# Altium schematic sheet Sheet_1_2020-05-15_10-06-48.schdoc
size 234 x 147 mm
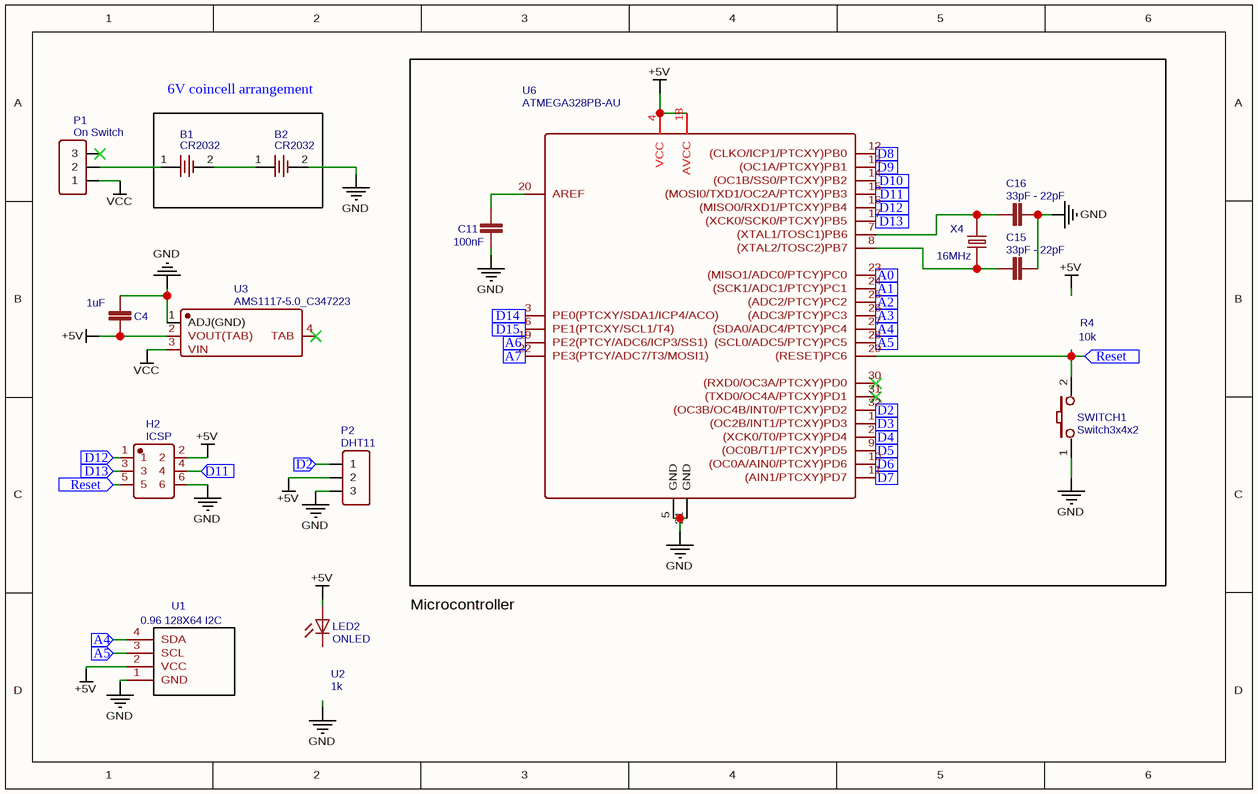
[diagram p0: Sheet_1_2020-05-15_10-06-48.schdoc]

## Parts
B1  CR2032  [BAT-TH_CR2032-BS-5-1]
B2  CR2032  [BAT-TH_CR2032-BS-5-1]
C4  1uF  [C805]
C11  100nF  [C805]
C15  33pF - 22pF  [C805]
C16  33pF - 22pF  [C805]
H2  ICSP  [HDR-TH_6P-P2.54-V-R2-C3-S2.54]
LED2  ONLED  [CHIPLED_0805]
P1  On Switch  [HDR-TH_3P-P2.54-V]
P2  DHT11  [HDR-TH_3P-P2.54-V]
R4  10k  [1206]
SWITCH1  Switch3x4x2  [KEY-3.0*4.0]
U1  0.96 128X64 I2C  [0.96 128X64 I2C SSD1306 OLED WHITE/BLUE]
U2  1k  [1206]
U3  AMS1117-5.0_C347223  [SOT-223_L6.7-W3.5-P2.30-BR]
U6  ATMEGA328PB-AU  [TQFP-32_7X7X08P]
X4  16MHz  [HC-49S_L11.4-W4.8]

## Blocks framed on the sheet
6V coincell arrangement: B1 B2

## Ports
A0 (in), A1 (in), A2 (in), A3 (in), A4 (in), A5 (in), A6 (in), A7 (in), D2 (in), D3 (in), D4 (in), D5 (in), D6 (in), D7 (in), D8 (in), D9 (in), D10 (in), D11 (in), D12 (in), D13 (in), D14 (in), D15 (in), Reset (in)

## Nets
+5V: C4.2 H2.2 LED2.A P2.2 U1.2(VCC) U3.2(VOUT(TAB)) U6.4(VCC) U6.18(AVCC)
GND: B2.2 C4.1 C11.2 C15.2 C16.1 H2.6 P2.3 SWITCH1.1 U1.1(GND) U3.1(ADJ(GND)) U6.5(GND) U6.21(GND)
VCC: P1.1 U3.3(VIN)
A0: U6.23((MISO1/ADC0/PTCY)PC0) ; port A0
A1: U6.24((SCK1/ADC1/PTCY)PC1) ; port A1
A2: U6.25((ADC2/PTCY)PC2) ; port A2
A3: U6.26((ADC3/PTCY)PC3) ; port A3
A4: U1.4(SDA) U6.27((SDA0/ADC4/PTCY)PC4) ; port A4
A5: U1.3(SCL) U6.28((SCL0/ADC5/PTCY)PC5) ; port A5
A6: U6.19(PE2(PTCY/ADC6/ICP3/SS1)) ; port A6
A7: U6.22(PE3(PTCY/ADC7/T3/MOSI1)) ; port A7
D2: P2.1 U6.32((OC3B/OC4B/INT0/PTCXY)PD2) ; port D2
D3: U6.1((OC2B/INT1/PTCXY)PD3) ; port D3
D4: U6.2((XCK0/T0/PTCXY)PD4) ; port D4
D5: U6.9((OC0B/T1/PTCXY)PD5) ; port D5
D6: U6.10((OC0A/AIN0/PTCXY)PD6) ; port D6
D7: U6.11((AIN1/PTCXY)PD7) ; port D7
D8: U6.12((CLKO/ICP1/PTCXY)PB0) ; port D8
D9: U6.13((OC1A/PTCXY)PB1) ; port D9
D10: U6.14((OC1B/SS0/PTCXY)PB2) ; port D10
D11: H2.4 U6.15((MOSI0/TXD1/OC2A/PTCXY)PB3) ; port D11
D12: H2.1 U6.16((MISO0/RXD1/PTCXY)PB4) ; port D12
D13: H2.3 U6.17((XCK0/SCK0/PTCXY)PB5) ; port D13
D14: U6.3(PE0(PTCXY/SDA1/ICP4/ACO)) ; port D14
D15: U6.6(PE1(PTCXY/SCL1/T4)) ; port D15
Reset: H2.5 SWITCH1.2 U6.29((RESET)PC6) ; port Reset
NetB1_1: B1.1 P1.2
NetB1_2: B1.2 B2.1
NetC11_1: C11.1 U6.20(AREF)
NetC15_1: C15.1 U6.8((XTAL2/TOSC2)PB7) X4.2
NetC16_2: C16.2 U6.7((XTAL1/TOSC1)PB6) X4.1

Not connected (* = marked no-connect by the designer): LED2 C; P1 3*; U3 4(TAB)*; U6 30((RXD0/OC3A/PTCXY)PD0)* 31((TXD0/OC4A/PTCXY)PD1)*

## Notes on the sheet
- Microcontroller

## Library data of the parts
B1 B2 = CR2032: BOM_Manufacturer: Q&J; BOM_Manufacturer Part: CR2032-BS-5-1; BOM_Supplier: LCSC; image: //image.lceda.cn/szlcsc/C70379.jpg; BOM_Supplier Part: C70379; spicePre: B; spiceSymbolName: CR2032-BS-5-1
C4 = 1uF: description: Non-Polarized capacitor in various packages; Contributor: DangerousPrototype; BOM_Manufacturer Part: ?; spicePre: C
C11 = 100nF: description: Non-Polarized capacitor in various packages; Contributor: DangerousPrototype; BOM_Manufacturer Part: ?; spicePre: C
C15 C16 = 33pF - 22pF: description: Non-Polarized capacitor in various packages; Contributor: DangerousPrototype; BOM_Manufacturer Part: ?; spicePre: C
H2 = ICSP: BOM_Manufacturer: ReliaPro; BOM_Manufacturer Part: Female header/2.54mm2x3 Female header; BOM_Supplier Part: C47552; BOM_Supplier: LCSC; spicePre: H
LED2 = ONLED: description: LED; Contributor: Adafruit; BOM_Manufacturer Part: ?; spicePre: L
P1 = On Switch: BOM_Manufacturer: Boom Precision Elec; BOM_Manufacturer Part: Header-Female-2.54_1x3; BOM_Supplier Part: C146243; BOM_Supplier: LCSC; link: https://datasheet.lcsc.com/szlcsc/Boom-Precision-Elec-2-54mm-1-8P-Straight-Female-header_C27438.pdf; spicePre: P; spiceSymbolName: Header-Female-2.54_1x3
P2 = DHT11: BOM_Manufacturer: Boom Precision Elec; BOM_Manufacturer Part: Header-Female-2.54_1x3; BOM_Supplier Part: C146243; BOM_Supplier: LCSC; link: https://datasheet.lcsc.com/szlcsc/Boom-Precision-Elec-2-54mm-1-8P-Straight-Female-header_C27438.pdf; spicePre: P; spiceSymbolName: Header-Female-2.54_1x3
R4 = 10k: BOM_Manufacturer: Ever Ohms Tech; BOM_Manufacturer Part: HR1206F680KP05; Contributor: LCSC; nameAlias: Resistance (Ohms); BOM_Supplier: LCSC; BOM_Supplier Part: C175506; spicePre: U; spiceSymbolName: HR1206F680KP05
SWITCH1 = Switch3x4x2: BOM_Manufacturer: ReliaPro; BOM_Supplier: LCSC; BOM_Manufacturer Part: Switch3x4x2; BOM_Supplier Part: C26638; spicePre: K
U1 = 0.96 128X64 I2C: BOM_Manufacturer: WAVGAT; BOM_Manufacturer Part: OLED 4PIN; Contributor: koendv; link: https://www.aliexpress.com/item/32830523451.html; spicePre: U; spiceSymbolName: 0.96 128X64 I2C SSD1306 OLED WHITE/BLUE
U2 = 1k: BOM_Manufacturer: Ever Ohms Tech; BOM_Manufacturer Part: HR1206F680KP05; Contributor: LCSC; nameAlias: Resistance (Ohms); BOM_Supplier: LCSC; BOM_Supplier Part: C175506; spicePre: U; spiceSymbolName: HR1206F680KP05
U3 = AMS1117-5.0_C347223: BOM_Manufacturer: Youtai Semiconductor Co., Ltd.; Contributor: LCSC; BOM_Supplier: LCSC; BOM_Supplier Part: C347223; BOM_Manufacturer Part: AMS1117-5.0; spicePre: U
U6 = ATMEGA328PB-AU: BOM_Manufacturer: MICROCHIP; Contributor: LCSC; SMT Type: Extend; BOM_Supplier: LCSC; BOM_Manufacturer Part: ATMEGA328PB-AU; BOM_Supplier Part: C132230; BOM_LCSC Assembly: Yes; spicePre: U
X4 = 16MHz: BOM_Manufacturer: TAE; BOM_Manufacturer Part: HC-49SM16MHz20pF30ppm; nameAlias: Frequency; BOM_Supplier: LCSC; BOM_Supplier Part: C111377; spicePre: X; spiceSymbolName: HC-49SM16MHz20pF30ppm